# Altium schematic sheet IMU-ICM-4267-P .SchDoc
size A4; SheetNumber: 32; SheetTotal: 32
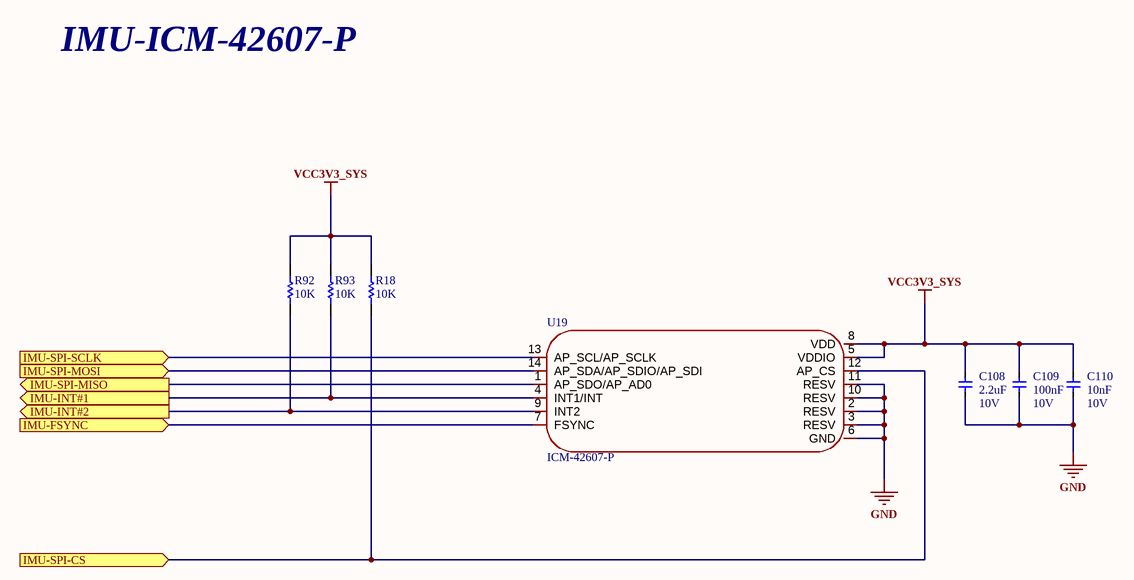
[diagram p0: IMU-ICM-4267-P .SchDoc]

## Parts
C108  2.2uF  VoltageRate: 10V  [CAP-0603]
C109  100nF  VoltageRate: 10V  [CAP-0402]
C110  10nF  VoltageRate: 10V  [CAP-0402]
R18  10K  [RES-0402]
R92  10K  [RES-0402]
R93  10K  [RES-0402]
U19  ICM-42607-P  [LGA-14_L3.0-W2.5-P0.50-TL_QMI8658A]

## Ports
IMU-FSYNC (in, see Controller-RK3562-TOP[2D], STM32G070RBT6[4C]), IMU-INT#1 (out, see Controller-RK3562-TOP[2C], STM32G070RBT6[4C]), IMU-INT#2 (out, see Controller-RK3562-TOP[2C], STM32G070RBT6[4B]), IMU-SPI-CS (in, see Controller-RK3562-TOP[2C], STM32G070RBT6[2C]), IMU-SPI-MISO (out, see Controller-RK3562-TOP[2C], STM32G070RBT6[2C]), IMU-SPI-MOSI (in, see Controller-RK3562-TOP[2C], STM32G070RBT6[2C]), IMU-SPI-SCLK (in, see Controller-RK3562-TOP[2C], STM32G070RBT6[2C])

## Nets
GND: C108.1 C109.1 C110.1 U19.2(RESV) U19.3(RESV) U19.6(GND) U19.10(RESV) U19.11(RESV)
VCC3V3_SYS: C108.2 C109.2 C110.2 R18.1 R92.1 R93.1 U19.5(VDDIO) U19.8(VDD)
IMU-FSYNC: U19.7(FSYNC) ; port IMU-FSYNC
IMU-INT#1: R93.2 U19.4(INT1/INT) ; port IMU-INT#1
IMU-INT#2: R92.2 U19.9(INT2) ; port IMU-INT#2
IMU-SPI-CS: R18.2 U19.12(AP_CS) ; port IMU-SPI-CS
IMU-SPI-MISO: U19.1(AP_SDO/AP_AD0) ; port IMU-SPI-MISO
IMU-SPI-MOSI: U19.14(AP_SDA/AP_SDIO/AP_SDI) ; port IMU-SPI-MOSI
IMU-SPI-SCLK: U19.13(AP_SCL/AP_SCLK) ; port IMU-SPI-SCLK

## Notes on the sheet
- IMU-ICM-42607-P

## Library data of the parts
C108-C110 = Capacitor-1: ManufacturingPartNumber: *; Manufacturer: *; SupplierPartNumber: *; Supplier: *
R18 R92 R93 = Resistor-1: ManufacturingPartNumber: *; Manufacturer: *; SupplierPartNumber: *; Supplier: *; VoltageRate: *
U19 = ICM-42607-P: ManufacturingPartNumber: *; Manufacturer: *; SupplierPartNumber: *; Supplier: *; VoltageRate: *